# Altium schematic sheet Power.SchDoc: {Наименование}
size 209 x 297 mm; DocumentNumber: {Обозначение}; SheetNumber: {}; SheetTotal: {}; PageSetup: Record=PageOptions|CenterHorizontal=False|CenterVertical=False|PrintScale=0.95|XCorrection=0.00|YCorrection=0.00|PrintKind=1|BorderSize=5000000|LeftOffset=0|BottomOffset=0|Orientation=1|PaperLength=1000|PaperWidth=1000|Scale=100|PaperSource=15|PrintQuality=600|MediaType=1|DitherType=10|PaperKind=A4|PrintScaleMode=1; Rule: PcbType=ProtelPcb
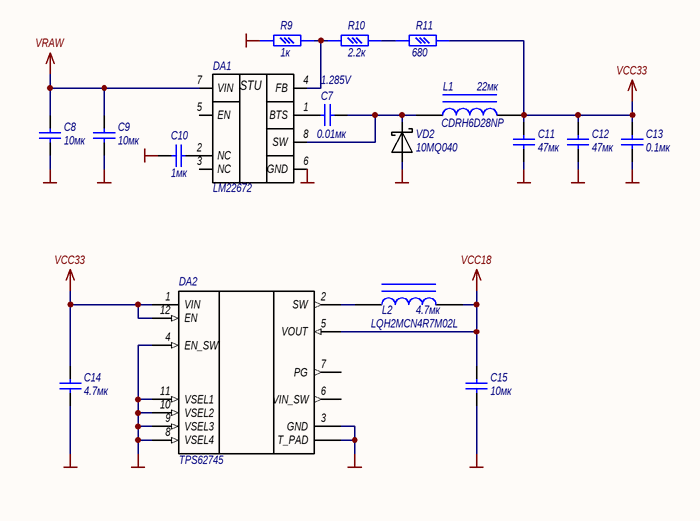
[diagram p0: Power.SchDoc]

## Parts
C7  value 0.01мк  [CAPC3216L]  (hidden comment: CL31B103KBCNNN)
C8  value 10мк  [CAPC3216L]  (hidden comment: CL31A106KBHNNN)
C9  value 10мк  [CAPC3216L]  (hidden comment: CL31A106KBHNNN)
C10  value 1мк  [CAPC1608L]  (hidden comment: CL10A105KA5LNN)
C11  value 47мк  [CAPC3225L]  (hidden comment: CL32A476MQJNNN)
C12  value 47мк  [CAPC3225L]  (hidden comment: CL32A476MQJNNN)
C13  value 0.1мк  [CAPC3216L]  (hidden comment: CL31B104KACNNN)
C14  value 4.7мк  [CAPC1005L]  (hidden comment: CL05A475MQ5NRN)
C15  value 10мк  [CAPC1608L]  (hidden comment: CL10A106MO8NQN)
DA1  LM22672  [MRA08B_N]
DA2  TPS62745  [WSON-12]
L1  CDRH6D28NP  value 22мк  [CDRH6D38]
L2  LQH2MCN4R7M02L  value 4.7мк  [INDUCTOR0806]
R9  value 1к  [RESC1608L]  (hidden comment: RC1608J102CS)
R10  value 2.2к  [RESC1608L]  (hidden comment: RC1608J222CS)
R11  value 680  [RESC1608L]  (hidden comment: RC1608J681CS)
VD2  10MQ040  [SMA_]

## Nets
GND: C8.1 C9.1 C10.1 C11.1 C12.1 C13.1 C14.1 C15.1 DA1.6(GND) DA2.3(GND) DA2.4(EN_SW) DA2.8(VSEL4) DA2.9(VSEL3) DA2.10(VSEL2) DA2.11(VSEL1) DA2.13(T_PAD) R9.1 VD2.1
VCC18: C15.2 DA2.5(VOUT) L2.2
VCC33: C11.2 C12.2 C13.2 C14.2 DA2.1(VIN) DA2.12(EN) L1.2 R11.2
VRAW: C8.2 C9.2 DA1.7(VIN)
NetC7_1: C7.1 DA1.8(SW) L1.1 VD2.2
NetC7_2: C7.2 DA1.1(BTS)
NetC10_2: C10.2 DA1.2(NC)
NetDA1_4: DA1.4(FB) R9.2 R10.1
NetDA2_2: DA2.2(SW) L2.1
NetR10_2: R10.2 R11.1

Not connected (* = marked no-connect by the designer): DA1 3(NC) 5(EN); DA2 6(VIN_SW) 7(PG)

## Notes on the sheet
- 1.285V
- Подп. и дата
- Инв. № дубл.
- Взам. инв. №
- Инв. № подл.
- Лист
- Изм.
- № докум.
- Подп.
- Дата
- (in symbol LM2674MX-XXX) STU

## Library data of the parts
C7 = CL31B103KBCNNN: Samsung MLCC Capacitor; Power/Voltage: 50В; Rem: SMD; Tolerance: ±10%; TU/GOST: EIA CC1206; ТКЕ/ТКС: X7R; VAL: 103; Manufacturer: Samsung; ManufacturerPartNumber: CL31B103KBCNNN; PackageReference: 1206; Range: *; Part Number: CL31B103KBCNNN; Pin Count: 2; Published: 01.05.2013; Publisher: Komiss Labs.
C8 C9 = CL31A106KBHNNN: Samsung MLCC Capacitor; Power/Voltage: 50В; Rem: SMD; Tolerance: ±10%; TU/GOST: EIA CC1206; ТКЕ/ТКС: X5R; VAL: 106; Designator: C?; Manufacturer: Samsung; ManufacturerPartNumber: CL31A106KBHNNN; PackageReference: 1206; Range: *; Part Number: CL31A106KBHNNN; Pin Count: 2; Published: 01.05.2013; Publisher: Komiss Labs.
C10 = CL10A105KA5LNN: Samsung MLCC Capacitor; Power/Voltage: 25В; Rem: SMD; Tolerance: ±10%; TU/GOST: EIA CC0603; ТКЕ/ТКС: X5R; VAL: 105; Designator: C?; Manufacturer: Samsung; ManufacturerPartNumber: CL10A105KA5LNN; PackageReference: 0603; Range: *; Part Number: CL10A105KA5LNN; Pin Count: 2; Published: 01.05.2013; Publisher: Komiss Labs.
C11 C12 = CL32A476MQJNNN: Samsung MLCC Capacitor; Power/Voltage: 6.3В; Rem: SMD; Tolerance: ±20%; TU/GOST: EIA CC1210; ТКЕ/ТКС: X5R; VAL: 476; Manufacturer: Samsung; ManufacturerPartNumber: CL32A476MQJNNN; PackageReference: 1210; Range: *; Part Number: CL32A476MQJNNN; Pin Count: 2; Published: 01.05.2013; Publisher: Komiss Labs.
C13 = CL31B104KACNNN: Samsung MLCC Capacitor; Power/Voltage: 25В; Rem: SMD; Tolerance: ±10%; TU/GOST: EIA CC1206; ТКЕ/ТКС: X7R; VAL: 104; Manufacturer: Samsung; ManufacturerPartNumber: CL31B104KACNNN; PackageReference: 1206; Range: *; Part Number: CL31B104KACNNN; Pin Count: 2; Published: 01.05.2013; Publisher: Komiss Labs.
C14 = CL05A475MQ5NRN: Samsung MLCC Capacitor; Power/Voltage: 6.3В; Rem: SMD; Tolerance: ±20%; TU/GOST: EIA CC0402; ТКЕ/ТКС: X5R; VAL: 475; Designator: C?; Manufacturer: Samsung; ManufacturerPartNumber: CL05A475MQ5NRN; PackageReference: 0402; Range: *; Part Number: CL05A475MQ5NRN; Pin Count: 2; Published: 01.05.2013; Publisher: Komiss Labs.
C15 = CL10A106MO8NQN: Samsung MLCC Capacitor; Power/Voltage: 16В; Rem: SMD; Tolerance: ±20%; TU/GOST: EIA CC0603; ТКЕ/ТКС: X5R; VAL: 106; Designator: C?; Manufacturer: Samsung; ManufacturerPartNumber: CL10A106MO8NQN; PackageReference: 0603; Range: *; Part Number: CL10A106MO8NQN; Pin Count: 2; Published: 01.05.2013; Publisher: Komiss Labs.
DA1 = LM2674MX-XXX: 40 V, 0.5A Simple Switcher, Step-Down; Manufacturer: Texas Instruments; ManufacturerPartnumber: LM22672; packagereference: SOIC-8
DA2 = TPS62745: Dual-cell Ultra Low IQ Step Down Converter for Low Power Wireless  Applications; Manufacturer: Texas Instruments; REM: SMD; ManufacturerPartNumber: TPS62745; PackageReference: WSON-12
L1 = Inductor Iron: Magnetic-Core Inductor; Manufacturer: Sumida; ManufacturerPartNumber: CDRH6D28NP-220NC; Rem: SMD; Tolerance: ±10%; Published: 24-Mar-1999; LatestRevisionDate: 17-Jul-2002; LatestRevisionNote: Re-released for DXP Platform.; PackageReference: AXIAL-0.9; Publisher: Altium Limited
L2 = Inductor Iron: Magnetic-Core Inductor; Manufacturer: Sumida; Rem: SMD; Tolerance: ±10%; Published: 24-Mar-1999; LatestRevisionDate: 17-Jul-2002; LatestRevisionNote: Re-released for DXP Platform.; PackageReference: AXIAL-0.9; Publisher: Altium Limited; ManufacturerPartNumber: LQH2MCN4R7M02L
R9 = RC1608J102CS: General Thick Film Chip Resistor; Manufacturer: Samsung; Power/Voltage: 0.1Вт; Tolerance: ±5%; Rem: SMD; Check: NO; ТКЕ/ТКС: ±250ppm/°C; TU/GOST: EIA RES0603; Designator: R?; F47: 1000,0; ManufacturerPartNumber: RC1608J102CS; PackageReference: 0603; Name: RC1608J102CS; Type: Резистор; Part Number: RC1608J102CS; Pin Count: 2; Published: 01.05.2013; Publisher: Komiss Labs.
R10 = RC1608J222CS: General Thick Film Chip Resistor; Manufacturer: Samsung; Power/Voltage: 0.1Вт; Tolerance: ±5%; Rem: SMD; Check: NO; ТКЕ/ТКС: ±250ppm/°C; TU/GOST: EIA RES0603; Designator: R?; F47: 2200,0; ManufacturerPartNumber: RC1608J222CS; PackageReference: 0603; Name: RC1608J222CS; Type: Резистор; Part Number: RC1608J222CS; Pin Count: 2; Published: 01.05.2013; Publisher: Komiss Labs.
R11 = RC1608J681CS: General Thick Film Chip Resistor; Manufacturer: Samsung; Power/Voltage: 0.1Вт; Tolerance: ±5%; Rem: SMD; Check: NO; ТКЕ/ТКС: ±250ppm/°C; TU/GOST: EIA RES0603; Designator: R?; F47: 680,0; ManufacturerPartNumber: RC1608J681CS; PackageReference: 0603; Name: RC1608J681CS; Type: Резистор; Part Number: RC1608J681CS; Pin Count: 2; Published: 01.05.2013; Publisher: Komiss Labs.
VD2 = 10MQ040: Schottky Barrier Diode; Manufacturer: International Rectifier; PackageReference: SMA(D-64); ManufacturerPartNumber: 10MQ040